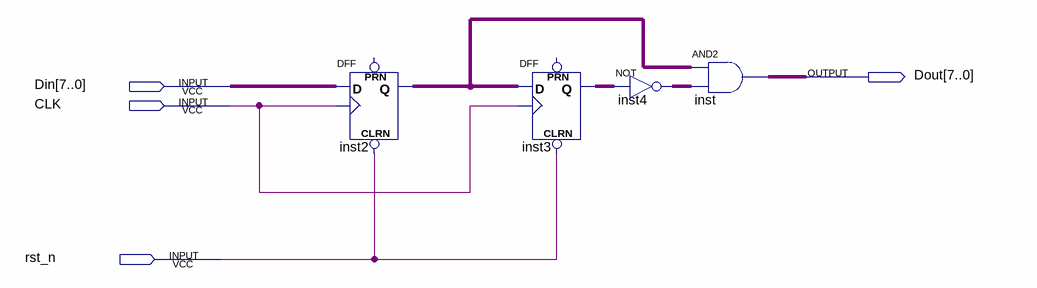
[diagram p0: schematic sheet]
// Quartus schematic trigger_8bit.bdf as structural Verilog: 4 symbols, 4 pins
module trigger_8bit (
  input  [7:0] Din,
  input  CLK,
  input  rst_n,
  output [7:0] Dout
);

  wire [7:0] inst2_q, inst3_q, inst4_out;

  DFF inst2[7:0] (.CLRN(rst_n), .CLK(CLK), .D(Din), .Q(inst2_q));  // open: PRN
  DFF inst3[7:0] (.CLRN(rst_n), .CLK(CLK), .D(inst2_q), .Q(inst3_q));  // open: PRN
  assign inst4_out = ~inst3_q;  // NOT inst4, 8 bits wide
  assign Dout = inst2_q & inst4_out;  // AND2 inst, 8 bits wide
endmodule
